# Altium schematic sheet usomiq.SchDoc
size A4
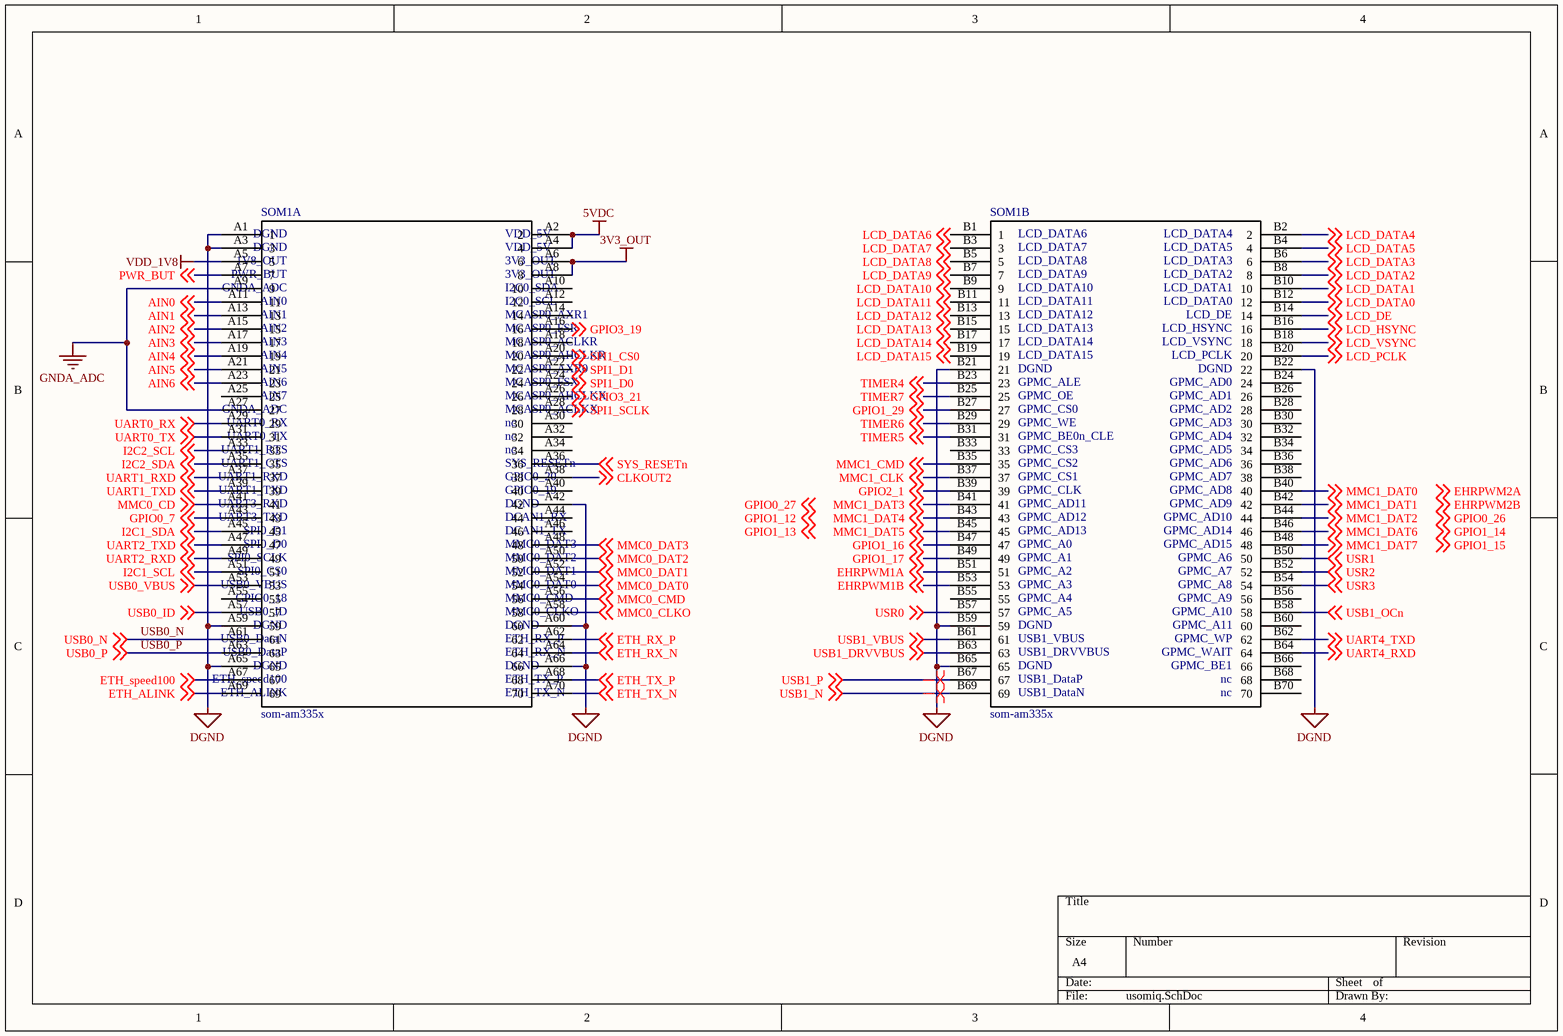
[diagram p0: usomiq.SchDoc]

## Parts
SOM1  som-am335x  [am3359_module-sockets]  (parts A,B of 2)

## Nets
3V3_OUT: SOM1.A6(6) SOM1.A8(8)
5VDC: SOM1.A2(2) SOM1.A4(4)
DGND: SOM1.A1(1) SOM1.A3(3) SOM1.A42(42) SOM1.A59(59) SOM1.A60(60) SOM1.A65(65) SOM1.A66(66) SOM1.B21(21) SOM1.B22(22) SOM1.B59(59) SOM1.B65(65)
GNDA_ADC: SOM1.A9(9) SOM1.A27(27)
VDD_1V8: SOM1.A5(5)
AIN0: SOM1.A11(11) ; off-sheet AIN0
AIN1: SOM1.A13(13) ; off-sheet AIN1
AIN2: SOM1.A15(15) ; off-sheet AIN2
AIN3: SOM1.A17(17) ; off-sheet AIN3
AIN4: SOM1.A19(19) ; off-sheet AIN4
AIN5: SOM1.A21(21) ; off-sheet AIN5
AIN6: SOM1.A23(23) ; off-sheet AIN6
CLKOUT2: SOM1.A38(38) ; off-sheet CLKOUT2
EHRPWM1A: SOM1.B51(51) ; off-sheet EHRPWM1A
EHRPWM1B: SOM1.B53(53) ; off-sheet EHRPWM1B
ETH_ALINK: SOM1.A69(69) ; off-sheet ETH_ALINK
ETH_RX_N: SOM1.A64(64) ; off-sheet ETH_RX_N
ETH_RX_P: SOM1.A62(62) ; off-sheet ETH_RX_P
ETH_speed100: SOM1.A67(67) ; off-sheet ETH_speed100
ETH_TX_N: SOM1.A70(70) ; off-sheet ETH_TX_N
ETH_TX_P: SOM1.A68(68) ; off-sheet ETH_TX_P
GPIO0_7: SOM1.A43(43) ; off-sheet GPIO0_7
GPIO1_16: SOM1.B47(47) ; off-sheet GPIO1_16
GPIO1_17: SOM1.B49(49) ; off-sheet GPIO1_17
GPIO1_29: SOM1.B27(27) ; off-sheet GPIO1_29
GPIO2_1: SOM1.B39(39) ; off-sheet GPIO2_1
GPIO3_19: SOM1.A16(16) ; off-sheet GPIO3_19
GPIO3_21: SOM1.A26(26) ; off-sheet GPIO3_21
I2C1_SCL: SOM1.A51(51) ; off-sheet I2C1_SCL
I2C1_SDA: SOM1.A45(45) ; off-sheet I2C1_SDA
I2C2_SCL: SOM1.A33(33) ; off-sheet I2C2_SCL
I2C2_SDA: SOM1.A35(35) ; off-sheet I2C2_SDA
LCD_DATA0: SOM1.B12(12) ; off-sheet LCD_DATA0
LCD_DATA1: SOM1.B10(10) ; off-sheet LCD_DATA1
LCD_DATA2: SOM1.B8(8) ; off-sheet LCD_DATA2
LCD_DATA3: SOM1.B6(6) ; off-sheet LCD_DATA3
LCD_DATA4: SOM1.B2(2) ; off-sheet LCD_DATA4
LCD_DATA5: SOM1.B4(4) ; off-sheet LCD_DATA5
LCD_DATA6: SOM1.B1(1) ; off-sheet LCD_DATA6
LCD_DATA7: SOM1.B3(3) ; off-sheet LCD_DATA7
LCD_DATA8: SOM1.B5(5) ; off-sheet LCD_DATA8
LCD_DATA9: SOM1.B7(7) ; off-sheet LCD_DATA9
LCD_DATA10: SOM1.B9(9) ; off-sheet LCD_DATA10
LCD_DATA11: SOM1.B11(11) ; off-sheet LCD_DATA11
LCD_DATA12: SOM1.B13(13) ; off-sheet LCD_DATA12
LCD_DATA13: SOM1.B15(15) ; off-sheet LCD_DATA13
LCD_DATA14: SOM1.B17(17) ; off-sheet LCD_DATA14
LCD_DATA15: SOM1.B19(19) ; off-sheet LCD_DATA15
LCD_DE: SOM1.B14(14) ; off-sheet LCD_DE
LCD_HSYNC: SOM1.B16(16) ; off-sheet LCD_HSYNC
LCD_PCLK: SOM1.B20(20) ; off-sheet LCD_PCLK
LCD_VSYNC: SOM1.B18(18) ; off-sheet LCD_VSYNC
MMC0_CD: SOM1.A41(41) ; off-sheet MMC0_CD
MMC0_CLKO: SOM1.A58(58) ; off-sheet MMC0_CLKO
MMC0_CMD: SOM1.A56(56) ; off-sheet MMC0_CMD
MMC0_DAT0: SOM1.A54(54) ; off-sheet MMC0_DAT0
MMC0_DAT1: SOM1.A52(52) ; off-sheet MMC0_DAT1
MMC0_DAT2: SOM1.A50(50) ; off-sheet MMC0_DAT2
MMC0_DAT3: SOM1.A48(48) ; off-sheet MMC0_DAT3
MMC1_CLK: SOM1.B37(37) ; off-sheet MMC1_CLK
MMC1_CMD: SOM1.B35(35) ; off-sheet MMC1_CMD
MMC1_DAT0: SOM1.B40(40) ; off-sheet MMC1_DAT0
MMC1_DAT1: SOM1.B42(42) ; off-sheet MMC1_DAT1
MMC1_DAT2: SOM1.B44(44) ; off-sheet MMC1_DAT2
MMC1_DAT3: SOM1.B41(41) ; off-sheet MMC1_DAT3
MMC1_DAT4: SOM1.B43(43) ; off-sheet MMC1_DAT4
MMC1_DAT5: SOM1.B45(45) ; off-sheet MMC1_DAT5
MMC1_DAT6: SOM1.B46(46) ; off-sheet MMC1_DAT6
MMC1_DAT7: SOM1.B48(48) ; off-sheet MMC1_DAT7
PWR_BUT: SOM1.A7(7) ; off-sheet PWR_BUT
SPI1_CS0: SOM1.A20(20) ; off-sheet SPI1_CS0
SPI1_D0: SOM1.A24(24) ; off-sheet SPI1_D0
SPI1_D1: SOM1.A22(22) ; off-sheet SPI1_D1
SPI1_SCLK: SOM1.A28(28) ; off-sheet SPI1_SCLK
SYS_RESETn: SOM1.A36(36) ; off-sheet SYS_RESETn
TIMER4: SOM1.B23(23) ; off-sheet TIMER4
TIMER5: SOM1.B31(31) ; off-sheet TIMER5
TIMER6: SOM1.B29(29) ; off-sheet TIMER6
TIMER7: SOM1.B25(25) ; off-sheet TIMER7
UART0_RX: SOM1.A29(29) ; off-sheet UART0_RX
UART0_TX: SOM1.A31(31) ; off-sheet UART0_TX
UART1_RXD: SOM1.A37(37) ; off-sheet UART1_RXD
UART1_TXD: SOM1.A39(39) ; off-sheet UART1_TXD
UART2_RXD: SOM1.A49(49) ; off-sheet UART2_RXD
UART2_TXD: SOM1.A47(47) ; off-sheet UART2_TXD
UART4_RXD: SOM1.B64(64) ; off-sheet UART4_RXD
UART4_TXD: SOM1.B62(62) ; off-sheet UART4_TXD
USB0_ID: SOM1.A57(57) ; off-sheet USB0_ID
USB0_N: SOM1.A61(61) ; off-sheet USB0_N
USB0_P: SOM1.A63(63) ; off-sheet USB0_P
USB0_VBUS: SOM1.A53(53) ; off-sheet USB0_VBUS
USB1_DRVVBUS: SOM1.B63(63) ; off-sheet USB1_DRVVBUS
USB1_N: SOM1.B69(69) ; off-sheet USB1_N
USB1_OCn: SOM1.B58(58) ; off-sheet USB1_OCn
USB1_P: SOM1.B67(67) ; off-sheet USB1_P
USB1_VBUS: SOM1.B61(61) ; off-sheet USB1_VBUS
USR0: SOM1.B57(57) ; off-sheet USR0
USR1: SOM1.B50(50) ; off-sheet USR1
USR2: SOM1.B52(52) ; off-sheet USR2
USR3: SOM1.B54(54) ; off-sheet USR3

Not connected (* = marked no-connect by the designer): SOM1 A10(10) A12(12) A14(14) A18(18) A25(25) A30(30) A32(32) A34(34) A40(40) A44(44) A46(46) A55(55) B24(24) B26(26) B28(28) B30(30) B32(32) B33(33) B34(34) B36(36) B38(38) B55(55) B56(56) B60(60) B66(66) B68(68) B70(70)

## Layout directives
differential pair: USB1_N, USB1_P

## Notes on the sheet
- Labels drawn without touching a wire or pin: EHRPWM2A, EHRPWM2B, GPIO0_26, GPIO0_27, GPIO1_12, GPIO1_13, GPIO1_14, GPIO1_15
- (in symbol som-am335x, part A) DGND; VDD_5V; 1V8_OUT; 3V3_OUT; PWR_BUT; GNDA_ADC; I2C0_SDA; AIN0; I2C0_SCL; AIN1; MCASP0_AXR1; AIN2; MCASP0_FSR; AIN3; MCASP0_ACLKR; AIN4; MCASP0_AHCLKR; AIN5; MCASP0_AXR0; AIN6; MCASP0_FSX; AIN7; MCASP0_AHCLKX; MCASP0_ACLKX; UART0_RX; nc; UART0_TX; UART1_RTS; UART1_CTS; SYS_RESETn; UART1_RXD; GPIO0_20; UART1_TXD; GPIO0_19; UART3_RXD; UART3_TXD; DCAN1_RX; SPI0_D1; DCAN1_TX; SPI0_D0; MMC0_DAT3; SPI0_SCLK; MMC0_DAT2; SPI0_CS0; MMC0_DAT1; USB0_VBUS; MMC0_DAT0; GPIO0_18; MMC0_CMD; USB0_ID; MMC0_CLKO; USB0_DataN; ETH_RX_P; USB0_DataP; ETH_RX_N; ETH_speed100; ETH_TX_P; ETH_ALINK; ETH_TX_N
- (in symbol som-am335x, part B) LCD_DATA6; LCD_DATA4; LCD_DATA7; LCD_DATA5; LCD_DATA8; LCD_DATA3; LCD_DATA9; LCD_DATA2; LCD_DATA10; LCD_DATA1; LCD_DATA11; LCD_DATA0; LCD_DATA12; LCD_DE; LCD_DATA13; LCD_HSYNC; LCD_DATA14; LCD_VSYNC; LCD_DATA15; LCD_PCLK; DGND; GPMC_ALE; GPMC_AD0; GPMC_OE; GPMC_AD1; GPMC_CS0; GPMC_AD2; GPMC_WE; GPMC_AD3; GPMC_BE0n_CLE; GPMC_AD4; GPMC_CS3; GPMC_AD5; GPMC_CS2; GPMC_AD6; GPMC_CS1; GPMC_AD7; GPMC_CLK; GPMC_AD8; GPMC_AD11; GPMC_AD9; GPMC_AD12; GPMC_AD10; GPMC_AD13; GPMC_AD14; GPMC_A0; GPMC_AD15; GPMC_A1; GPMC_A6; GPMC_A2; GPMC_A7; GPMC_A3; GPMC_A8; GPMC_A4; GPMC_A9; GPMC_A5; GPMC_A10; GPMC_A11; USB1_VBUS; GPMC_WP; USB1_DRVVBUS; GPMC_WAIT; GPMC_BE1; USB1_DataP; nc; USB1_DataN